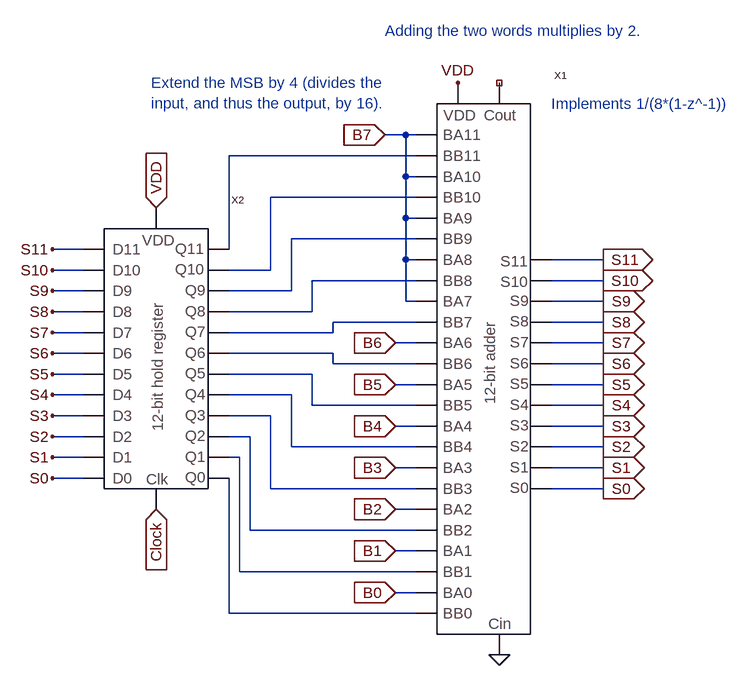
[diagram p0: schematic Integrator_non_delaying.asc]
Integrator_non_delaying.asc, the LTspice schematic file:
Version 4
SHEET 1 1932 932
WIRE 96 -1040 64 -1040
WIRE 112 -1040 96 -1040
WIRE 112 -1008 -176 -1008
WIRE 96 -976 96 -1040
WIRE 112 -976 96 -976
WIRE 112 -944 -112 -944
WIRE 96 -912 96 -976
WIRE 112 -912 96 -912
WIRE 112 -880 -80 -880
WIRE -400 -864 -448 -864
WIRE -176 -864 -176 -1008
WIRE 96 -848 96 -912
WIRE 112 -848 96 -848
WIRE 400 -848 320 -848
WIRE -400 -832 -448 -832
WIRE -112 -832 -112 -944
WIRE -112 -832 -176 -832
WIRE 112 -816 -48 -816
WIRE 400 -816 320 -816
WIRE -400 -800 -448 -800
WIRE -80 -800 -80 -880
WIRE -80 -800 -176 -800
WIRE 96 -784 96 -848
WIRE 112 -784 96 -784
WIRE 400 -784 320 -784
WIRE -400 -768 -448 -768
WIRE -48 -768 -48 -816
WIRE -48 -768 -176 -768
WIRE 112 -752 -16 -752
WIRE 400 -752 320 -752
WIRE -400 -736 -448 -736
WIRE -16 -736 -16 -752
WIRE -16 -736 -176 -736
WIRE 112 -720 80 -720
WIRE 400 -720 320 -720
WIRE -400 -704 -448 -704
WIRE -16 -704 -176 -704
WIRE -16 -688 -16 -704
WIRE 112 -688 -16 -688
WIRE 400 -688 320 -688
WIRE -400 -672 -448 -672
WIRE -48 -672 -176 -672
WIRE 112 -656 80 -656
WIRE 400 -656 320 -656
WIRE -400 -640 -448 -640
WIRE -80 -640 -176 -640
WIRE -48 -624 -48 -672
WIRE 112 -624 -48 -624
WIRE 400 -624 320 -624
WIRE -400 -608 -448 -608
WIRE -112 -608 -176 -608
WIRE 112 -592 80 -592
WIRE 400 -592 320 -592
WIRE -400 -576 -448 -576
WIRE -144 -576 -176 -576
WIRE -80 -560 -80 -640
WIRE 112 -560 -80 -560
WIRE 400 -560 320 -560
WIRE -400 -544 -448 -544
WIRE -160 -544 -176 -544
WIRE 112 -528 80 -528
WIRE 400 -528 320 -528
WIRE -400 -512 -448 -512
WIRE -112 -496 -112 -608
WIRE 112 -496 -112 -496
WIRE 400 -496 320 -496
WIRE 112 -464 80 -464
WIRE -144 -432 -144 -576
WIRE 112 -432 -144 -432
WIRE 112 -400 80 -400
WIRE -160 -368 -160 -544
WIRE 112 -368 -160 -368
WIRE 112 -336 80 -336
WIRE -176 -304 -176 -512
WIRE 112 -304 -176 -304
FLAG 64 -1040 B7
IOPIN 64 -1040 In
FLAG 80 -720 B6
IOPIN 80 -720 In
FLAG 80 -656 B5
IOPIN 80 -656 In
FLAG 80 -592 B4
IOPIN 80 -592 In
FLAG 80 -528 B3
IOPIN 80 -528 In
FLAG 80 -464 B2
IOPIN 80 -464 In
FLAG 80 -400 B1
IOPIN 80 -400 In
FLAG 80 -336 B0
IOPIN 80 -336 In
FLAG 176 -1120 VDD
FLAG 240 -240 0
FLAG -288 -928 VDD
IOPIN -288 -928 In
FLAG -288 -464 Clock
IOPIN -288 -464 In
FLAG 400 -848 S11
IOPIN 400 -848 Out
FLAG 400 -816 S10
IOPIN 400 -816 Out
FLAG 400 -784 S9
IOPIN 400 -784 Out
FLAG 400 -752 S8
IOPIN 400 -752 Out
FLAG 400 -720 S7
IOPIN 400 -720 Out
FLAG 400 -688 S6
IOPIN 400 -688 Out
FLAG 400 -656 S5
IOPIN 400 -656 Out
FLAG 400 -624 S4
IOPIN 400 -624 Out
FLAG 400 -592 S3
IOPIN 400 -592 Out
FLAG 400 -560 S2
IOPIN 400 -560 Out
FLAG 400 -528 S1
IOPIN 400 -528 Out
FLAG 400 -496 S0
IOPIN 400 -496 Out
FLAG -448 -864 S11
FLAG -448 -832 S10
FLAG -448 -800 S9
FLAG -448 -768 S8
FLAG -448 -736 S7
FLAG -448 -704 S6
FLAG -448 -672 S5
FLAG -448 -640 S4
FLAG -448 -608 S3
FLAG -448 -576 S2
FLAG -448 -544 S1
FLAG -448 -512 S0
SYMBOL 12_bit_adder 144 -272 R0
SYMATTR InstName X1
SYMBOL 12_bit_register -368 -496 R0
SYMATTR InstName X2
TEXT 320 -1088 Left 0 ;Implements 1/(8*(1-z^-1))
TEXT -296 -1120 Left 0 ;Extend the MSB by 4 (divides the \ninput, and thus the output, by 16).
TEXT 64 -1200 Left 0 ;Adding the two words multiplies by 2.

The netlist it stands for:
* Integrator_non_delaying.asc
XX1 VDD B0 N012 B1 N011 B2 N010 B3 N009 B4 N008 B5 N007 B6 N006 B7 N005 S0 NC_01 0 S1 S2 S3 S4 S5 S6 S7 S8 S9 S10 S11 B7 N004 B7 N003 B7 N002 B7 N001 12_bit_adder  ; pins VDD BA0 BB0 BA1 BB1 BA2 BB2 BA3 BB3 BA4 BB4 BA5 BB5 BA6 BB6 BA7 BB7 S0 Cout Cin S1 S2 S3 S4 S5 S6 S7 S8 S9 S10 S11 BA8 BB8 BA9 BB9 BA10 BB10 BA11 BB11
XX2 S0 S1 S2 S3 S4 S5 S6 S7 S8 S9 S10 S11 N012 N011 N010 N009 N008 N007 N006 N005 N004 N003 N002 N001 Clock VDD 12_bit_register  ; pins D0 D1 D2 D3 D4 D5 D6 D7 D8 D9 D10 D11 Q0 Q1 Q2 Q3 Q4 Q5 Q6 Q7 Q8 Q9 Q10 Q11 Clk VDD
* Implements 1/(8*(1-z^-1))
* Extend the MSB by 4 (divides the
* input, and thus the output, by 16).
* Adding the two words multiplies by 2.
.backanno
.end